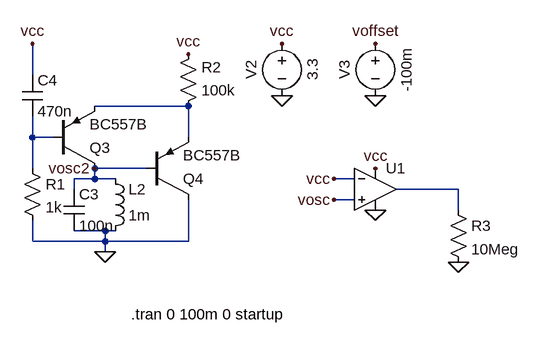
[diagram p0: schematic Two-Transistor-Oscillator.asc]
Two-Transistor-Oscillator.asc, the LTspice schematic file:
Version 4
SHEET 1 880 708
WIRE -64 -96 -64 -144
WIRE 176 -48 32 -48
WIRE -64 0 -64 -32
WIRE -32 0 -64 0
WIRE 176 0 176 -48
WIRE -64 48 -64 0
WIRE 112 48 32 48
WIRE 32 64 32 48
WIRE 32 64 0 64
WIRE 64 64 32 64
WIRE 432 64 400 64
WIRE 0 80 0 64
WIRE 592 80 496 80
WIRE 432 96 400 96
WIRE 592 112 592 80
WIRE 48 144 0 144
WIRE 64 144 48 144
WIRE -64 160 -64 128
WIRE 48 160 48 144
WIRE 48 160 -64 160
WIRE 176 160 176 96
WIRE 176 160 48 160
WIRE 48 176 48 160
FLAG 464 112 0
FLAG 320 -64 0
FLAG 592 192 0
FLAG 464 -64 0
FLAG 320 -144 vcc
FLAG 464 -144 voffset
FLAG 464 48 vcc
FLAG 400 64 vcc
FLAG 400 96 vosc
FLAG 32 48 vosc2
FLAG -64 -144 vcc
FLAG 176 -128 vcc
FLAG 48 176 0
SYMBOL OpAmps\\UniversalOpAmp2 464 80 R0
SYMATTR InstName U1
SYMBOL voltage 320 -160 R0
WINDOW 0 -32 56 VBottom 2
WINDOW 3 32 56 VTop 2
WINDOW 123 0 0 Left 0
WINDOW 39 0 0 Left 0
SYMATTR InstName V2
SYMATTR Value 3.3
SYMBOL res 576 96 R0
SYMATTR InstName R3
SYMATTR Value 10Meg
SYMBOL voltage 464 -160 R0
WINDOW 0 -32 56 VBottom 2
WINDOW 3 32 56 VTop 2
WINDOW 123 0 0 Left 0
WINDOW 39 0 0 Left 0
SYMATTR InstName V3
SYMATTR Value -100m
SYMBOL cap -16 144 M180
WINDOW 0 24 56 Left 2
WINDOW 3 24 8 Left 2
SYMATTR InstName C3
SYMATTR Value 100n
SYMATTR SpiceLine V=25 Rser=100m
SYMBOL ind 48 160 M180
WINDOW 0 36 80 Left 2
WINDOW 3 36 40 Left 2
SYMATTR InstName L2
SYMATTR Value 1m
SYMATTR SpiceLine Rser=100m
SYMBOL cap -80 -32 M180
WINDOW 0 24 56 Left 2
WINDOW 3 24 8 Left 2
SYMATTR InstName C4
SYMATTR Value 470n
SYMBOL res 160 -32 M180
WINDOW 0 36 76 Left 2
WINDOW 3 36 40 Left 2
SYMATTR InstName R2
SYMATTR Value 100k
SYMBOL pnp -32 48 M180
SYMATTR InstName Q3
SYMATTR Value BC557B
SYMBOL pnp 112 96 M180
SYMATTR InstName Q4
SYMATTR Value BC557B
SYMBOL res -80 32 R0
SYMATTR InstName R1
SYMATTR Value 1k
TEXT 88 272 Left 2 !.tran 0 100m 0 startup

The netlist it stands for:
* Two-Transistor-Oscillator.asc
XU1 vosc vcc vcc 0 N003 level2 Avol=1Meg GBW=10Meg Slew=10Meg Ilimit=25m Rail=0 Vos=0 En=0 Enk=0 In=0 Ink=0 Rin=500Meg  ; pins In+ In- V+ V- OUT
V2 vcc 0 3.3
R3 N003 0 10Meg
V3 voffset 0 -100m
C3 0 vosc2 100n V=25 Rser=100m
L2 0 vosc2 1m Rser=100m
C4 N002 vcc 470n
R2 N001 vcc 100k
Q3 vosc2 N002 N001 0 BC557B
Q4 0 vosc2 N001 0 BC557B
R1 N002 0 1k
.model NPN NPN
.model PNP PNP
.lib standard.bjt
.tran 0 100m 0 startup
.lib UniversalOpAmp2.lib
.backanno
.end